# Altium project linkit-v4-hw.PrjPcb (part 1 of 2)
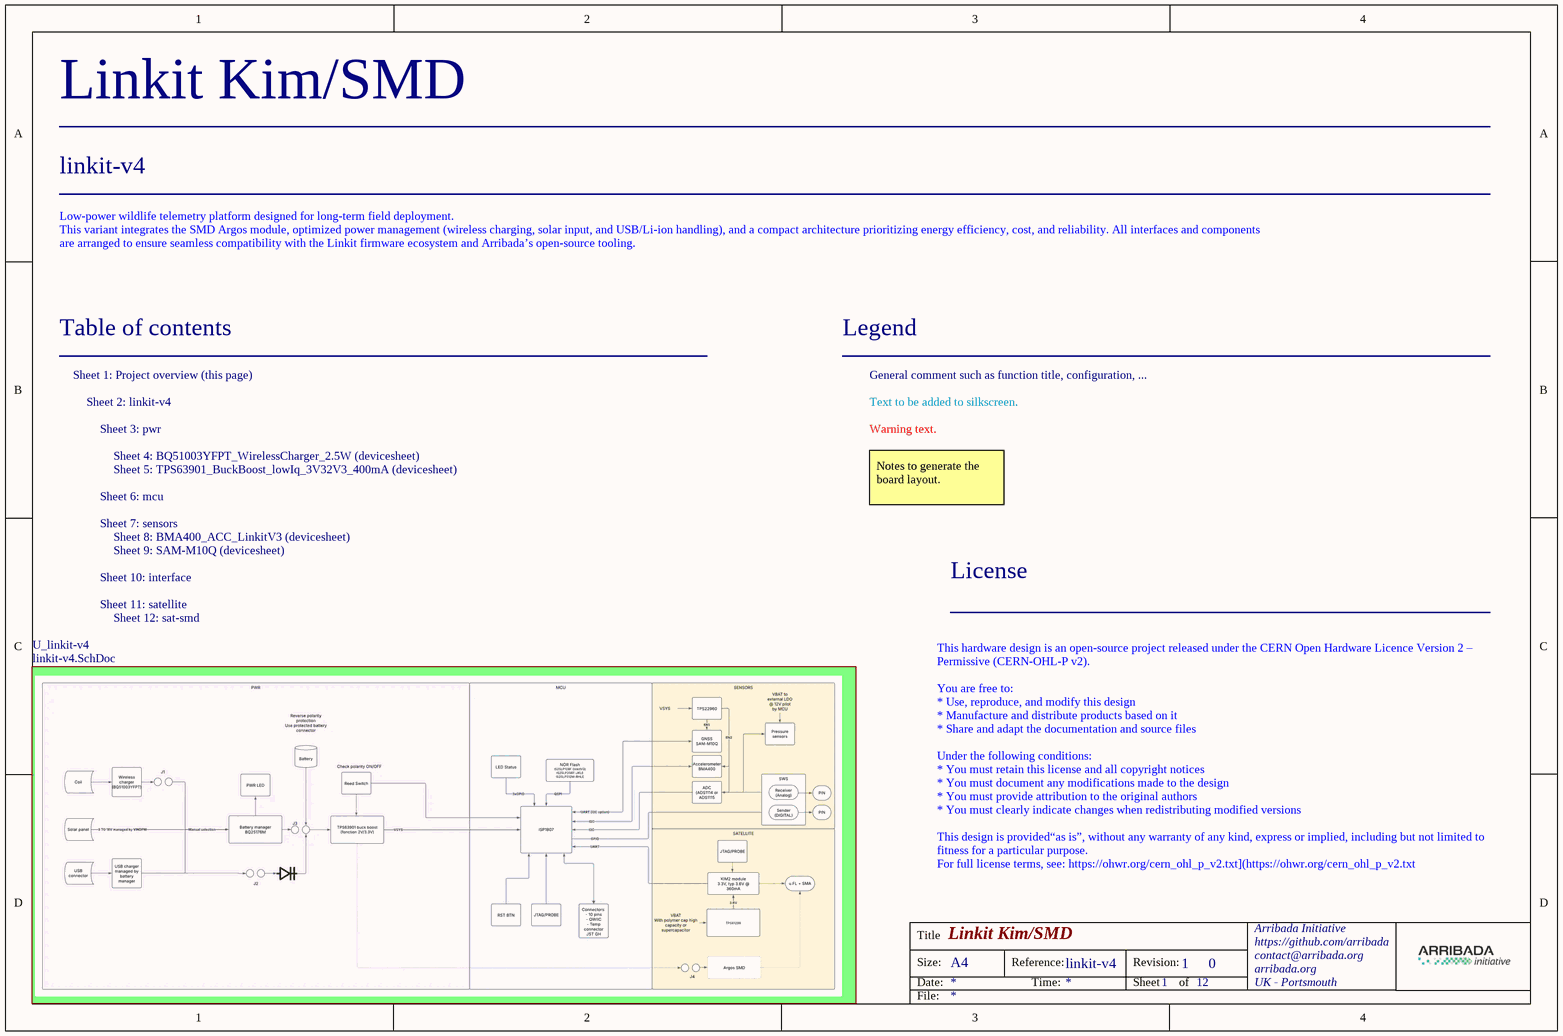
[diagram p0: Project_Overview.SchDoc]
Board_Assembly_Revision: 0; Board_Name: Linkit Kim/SMD; Board_PCB_Revision: 1; Board_Reference: linkit-v4
8 sheets, 140 parts. Net scope: flat (ports and power ports of the same name join across sheets).
Board file: linkit-v4-0.3_6layers_kimonly.PcbDoc
Sheets:
  Project_Overview.SchDoc
    U_linkit-v4 = linkit-v4.SchDoc
      ISP1807 = mcu.SchDoc
      Sensors = sensors.SchDoc
      Interface = interface.SchDoc
      Power = pwr.SchDoc
      Satellite = satellite.SchDoc
        KIM2 = sat-kim2.SchDoc

## Sheet Project_Overview.SchDoc
size A4; Organization: Arribada Initiative; Address1: https://github.com/arribada; Address2: contact@arribada.org; Address3: arribada.org; Address4: UK - Portsmouth; DocumentNumber: 1; SheetNumber: 1; SheetTotal: 12

### Sub-sheets
U_linkit-v4 = linkit-v4.SchDoc: no entries

### Notes on the sheet
- Low-power wildlife telemetry platform designed for long-term field deployment.
  This variant integrates the SMD Argos module, optimized power management (wireless charging, solar input, and USB/Li-ion handling), and a compact architecture prioritizing energy efficiency, cost, and reliability. All interfaces and components are arranged to ensure seamless compatibility with the Linkit firmware ecosystem and Arribada’s open-source tooling.
- Table of contents
- Sheet 1: Project overview (this page)
- Legend
- General comment such as function title, configuration, ...
- Sheet 2: linkit-v4
- Sheet 3: pwr
- Text to be added to silkscreen.
- Warning text.
- Sheet 6: mcu
- Sheet 4: BQ51003YFPT_WirelessCharger_2.5W (devicesheet)
- Sheet 5: TPS63901_BuckBoost_lowIq_3V32V3_400mA (devicesheet)
- Notes to generate the board layout.
- Sheet 7: sensors
- Sheet 10: interface
- Sheet 8: BMA400_ACC_LinkitV3 (devicesheet)
- Sheet 9: SAM-M10Q (devicesheet)
- License
- Sheet 11: satellite
- Sheet 12: sat-smd
- This hardware design is an open-source project released under the CERN Open Hardware Licence Version 2 – Permissive (CERN-OHL-P v2).
  You are free to:
  * Use, reproduce, and modify this design
  * Manufacture and distribute products based on it
  * Share and adapt the documentation and source files
  Under the following conditions:
  * You must retain this license and all copyright notices
  * You must document any modifications made to the design
  * You must provide attribution to the original authors
  * You must clearly indicate changes when redistributing modified versions
  This design is provided“as is”, without any warranty of any kind, express or implied, including but not limited to fitness for a particular purpose.
  For full license terms, see: https://ohwr.org/cern_ohl_p_v2.txt](https://ohwr.org/cern_ohl_p_v2.txt
  Attribution
  Designed and developed by **Arribada Initiative**
  https://arribada.org
- Title
- Size:
- Date:
- A4
- Reference:
- Time:
- Revision:
- Sheet
- of
- File:

## Sheet linkit-v4.SchDoc
size A4; Organization: Arribada Initiative; Address1: https://github.com/arribada; Address2: contact@arribada.org; Address3: arribada.org; Address4: UK - Portsmouth; DocumentNumber: 2; SheetNumber: 2; SheetTotal: 13
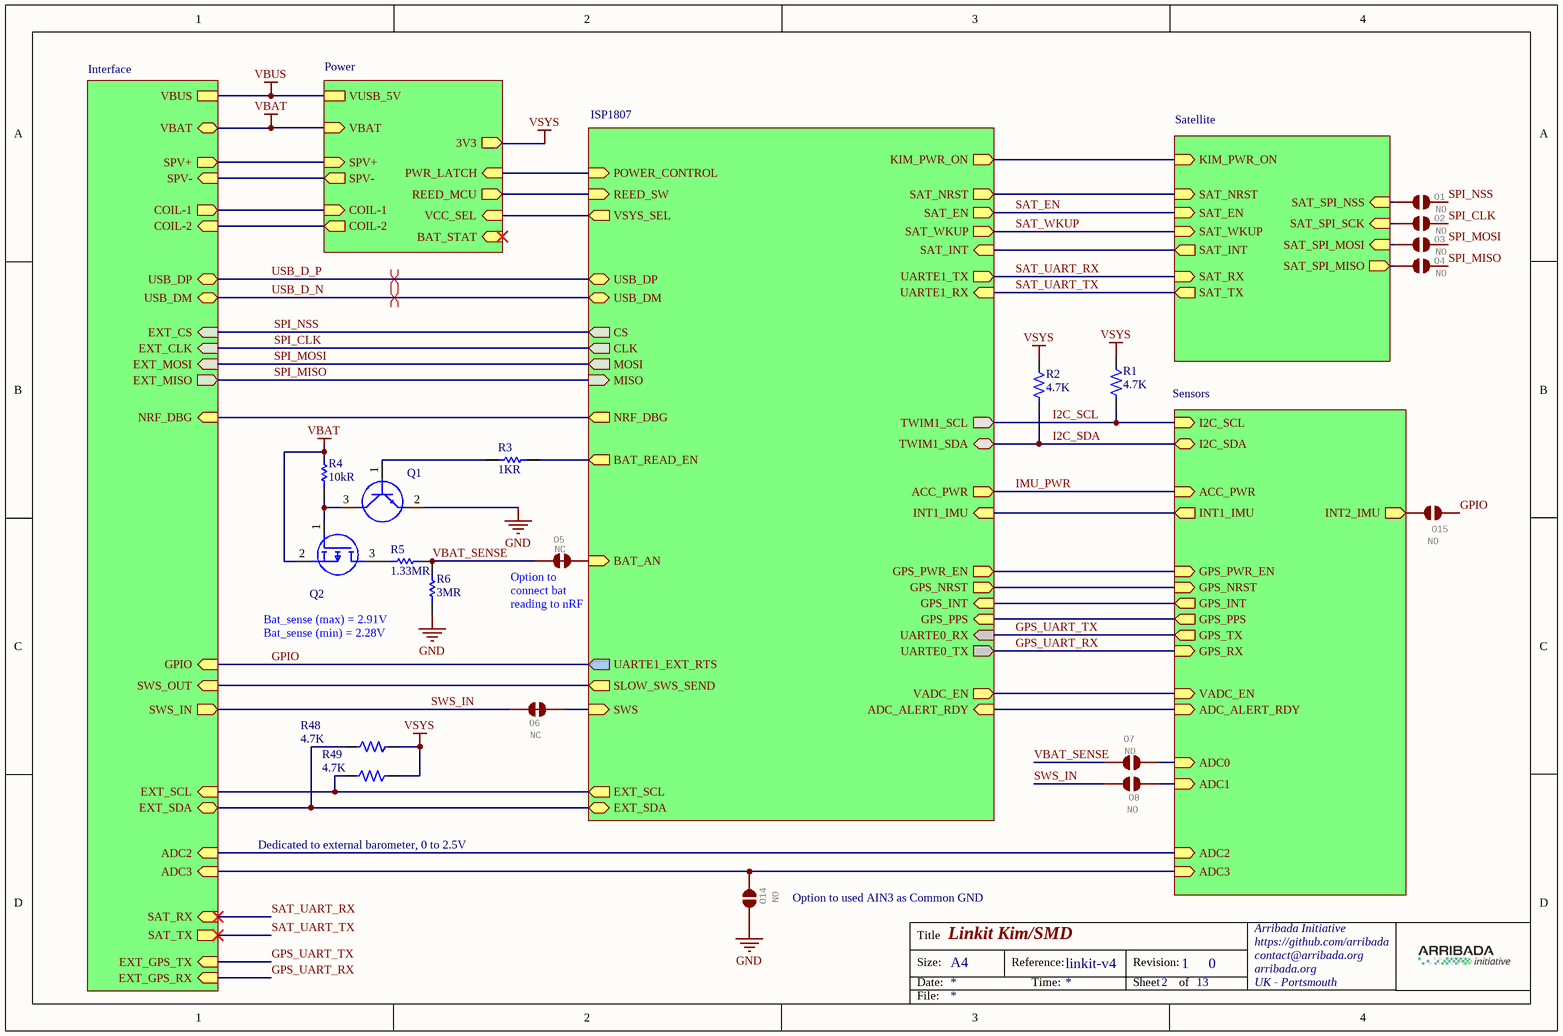
[diagram p1: linkit-v4.SchDoc]

### Parts
O1  NO  [SMT-JUMPER_2_NO_TRACE_SILK]  (net tie, no BOM)
O2  NO  [SMT-JUMPER_2_NO_TRACE_SILK]  (net tie, no BOM)
O3  NO  [SMT-JUMPER_2_NO_TRACE_SILK]  (net tie, no BOM)
O4  NO  [SMT-JUMPER_2_NO_TRACE_SILK]  (net tie, no BOM)
O5  NC  [SMT-JUMPER_2_NC_TRACE_SILK]  (net tie, no BOM)
O6  NC  [SMT-JUMPER_2_NC_TRACE_SILK]  (net tie, no BOM)
O7  NO  [SMT-JUMPER_2_NO_TRACE_SILK]  (net tie, no BOM)
O8  NO  [SMT-JUMPER_2_NO_TRACE_SILK]  (net tie, no BOM)
O14  NO  [SMT-JUMPER_2_NO_TRACE_SILK]  (net tie, no BOM)
O15  NO  [SMT-JUMPER_2_NO_TRACE_SILK]  (net tie, no BOM)
Q1  MMBT3904LT1G  [SOT96P237X111-3N]  (value not drawn)
Q2  DMP2305U-7  [SOT96P240X115-3N]  (value not drawn)
R1  value 4.7K  [RES0201L]  (hidden comment: 4.7K 0201 1% 100PPM)
R2  value 4.7K  [RES0201L]  (hidden comment: 4.7K 0201 1% 100PPM)
R3  1kR  [RESC0603X28N]
R4  value 10kR  [RESC1005X40N]  (hidden comment: CRCW040210K0JNEDC)
R5  value 1.33MR  [RESC2012X60N]  (hidden comment: RT0805BRD071M33L)
R6  value 3MR  [RESC3216X55N]  (hidden comment: RGV3216P-3004-B-T1)
R48  value 4.7K  [RES0201L]  (hidden comment: 4.7K 0201 1% 100PPM)
R49  value 4.7K  [RES0201L]  (hidden comment: 4.7K 0201 1% 100PPM)

### Sub-sheets
Interface = interface.SchDoc: USB_DP (bidir), USB_DM (bidir), VBUS, COIL-1 (out), COIL-2 (in), SWS_OUT (in), SWS_IN (out), EXT_CS (in), EXT_CLK (in), EXT_MISO (out), EXT_MOSI (in), NRF_DBG (in), ADC2 (in), EXT_SCL (in), EXT_SDA (bidir), VBAT (bidir), SAT_RX (in), SAT_TX (out), EXT_GPS_TX (in), EXT_GPS_RX (in), ADC3 (in), GPIO (in), SPV+ (out), SPV- (in)
ISP1807 = mcu.SchDoc: REED_SW (in), USB_DM (bidir), USB_DP (bidir), UARTE0_TX (out), UARTE0_RX (in), TWIM1_SCL (out), TWIM1_SDA (bidir), SWS (in), GPS_INT (in), UARTE1_EXT_RTS (out), VSYS_SEL (out), GPS_NRST (out), ADC_ALERT_RDY (in), CS (out), CLK (out), MISO (in), MOSI (out), SAT_NRST (out), SAT_INT (in), SAT_WKUP (out), SAT_EN (out), GPS_PWR_EN (out), BAT_AN (in), POWER_CONTROL (in), KIM_PWR_ON (out), SLOW_SWS_SEND (out), GPS_PPS (in), NRF_DBG (out), INT1_IMU (in), ACC_PWR (out), VADC_EN (out), BAT_READ_EN (out), UARTE1_TX (out), UARTE1_RX (in), EXT_SCL (out), EXT_SDA (bidir)
Power = pwr.SchDoc: VBAT (in), VCC_SEL (in), COIL-1 (in), COIL-2 (out), VUSB_5V, 3V3 (out), REED_MCU (out), PWR_LATCH (in), BAT_STAT (in), SPV+ (in), SPV- (out)
Satellite = satellite.SchDoc: SAT_RX (in), SAT_TX (out), SAT_WKUP (in), SAT_INT (out), SAT_EN (in), SAT_NRST (in), SAT_SPI_MISO (out), SAT_SPI_MOSI (in), SAT_SPI_NSS (in), SAT_SPI_SCK (in), KIM_PWR_ON (in)
Sensors = sensors.SchDoc: ADC0 (in), ADC1 (in), ADC2 (in), ADC_ALERT_RDY (in), VADC_EN (in), GPS_PWR_EN (in), GPS_RX (in), GPS_TX (out), GPS_NRST (in), GPS_INT (out), GPS_PPS (out), ACC_PWR (in), INT1_IMU (out), I2C_SCL (in), I2C_SDA (bidir), ADC3 (in), INT2_IMU (out)

### Nets
GND: O14.1 Q1.2(E) R6.2
VBAT: Q2.2(S) R4.1 ; sheet Interface/VBAT, sheet Power/VBAT
VBUS: sheet Interface/VBUS, sheet Power/VUSB_5V
VSYS: R1.2 R2.2 R48.2 R49.1 ; sheet Power/3V3
GPIO: O15.1 ; sheet ISP1807/UARTE1_EXT_RTS, sheet Interface/GPIO
GPS_UART_RX: sheet ISP1807/UARTE0_TX, sheet Sensors/GPS_RX, sheet Interface/EXT_GPS_RX
GPS_UART_TX: sheet ISP1807/UARTE0_RX, sheet Sensors/GPS_TX, sheet Interface/EXT_GPS_TX
I2C_SCL: R1.1 ; sheet ISP1807/TWIM1_SCL, sheet Sensors/I2C_SCL
I2C_SDA: R2.1 ; sheet ISP1807/TWIM1_SDA, sheet Sensors/I2C_SDA
IMU_PWR: sheet ISP1807/ACC_PWR, sheet Sensors/ACC_PWR
SAT_EN: sheet ISP1807/SAT_EN, sheet Satellite/SAT_EN
SAT_UART_RX: sheet ISP1807/UARTE1_TX, sheet Interface/SAT_RX, sheet Satellite/SAT_RX
SAT_UART_TX: sheet ISP1807/UARTE1_RX, sheet Interface/SAT_TX, sheet Satellite/SAT_TX
SAT_WKUP: sheet ISP1807/SAT_WKUP, sheet Satellite/SAT_WKUP
SPI_CLK: O2.2 ; sheet ISP1807/CLK, sheet Interface/EXT_CLK
SPI_MISO: O4.2 ; sheet ISP1807/MISO, sheet Interface/EXT_MISO
SPI_MOSI: O3.2 ; sheet ISP1807/MOSI, sheet Interface/EXT_MOSI
SPI_NSS: O1.2 ; sheet ISP1807/CS, sheet Interface/EXT_CS
SWS_IN: O6.1 O8.1 ; sheet Interface/SWS_IN
USB_D_N: sheet ISP1807/USB_DM, sheet Interface/USB_DM
USB_D_P: sheet ISP1807/USB_DP, sheet Interface/USB_DP
VBAT_SENSE: O5.1 O7.1 R5.2 R6.1
NetO1_1: O1.1 ; sheet Satellite/SAT_SPI_NSS
NetO2_1: O2.1 ; sheet Satellite/SAT_SPI_SCK
NetO3_1: O3.1 ; sheet Satellite/SAT_SPI_MOSI
NetO4_1: O4.1 ; sheet Satellite/SAT_SPI_MISO
NetO5_2: O5.2 ; sheet ISP1807/BAT_AN
NetO6_2: O6.2 ; sheet ISP1807/SWS
NetO7_2: O7.2 ; sheet Sensors/ADC0
NetO8_2: O8.2 ; sheet Sensors/ADC1
NetO14_2: O14.2 ; sheet Sensors/ADC3, sheet Interface/ADC3
NetO15_2: O15.2 ; sheet Sensors/INT2_IMU
NetQ1_1: Q1.1(B) R3.1
NetQ1_3: Q1.3(C) Q2.1(G) R4.2
NetQ2_3: Q2.3(D) R5.1
NetR3_2: R3.2 ; sheet ISP1807/BAT_READ_EN
NetR48_1: R48.1 ; sheet ISP1807/EXT_SDA, sheet Interface/EXT_SDA
NetR49_2: R49.2 ; sheet ISP1807/EXT_SCL, sheet Interface/EXT_SCL
(unnamed): sheet ISP1807/REED_SW, sheet Power/REED_MCU
(unnamed): sheet ISP1807/GPS_INT, sheet Sensors/GPS_INT
(unnamed): sheet ISP1807/VSYS_SEL, sheet Power/VCC_SEL
(unnamed): sheet ISP1807/GPS_NRST, sheet Sensors/GPS_NRST
(unnamed): sheet ISP1807/ADC_ALERT_RDY, sheet Sensors/ADC_ALERT_RDY
(unnamed): sheet ISP1807/SAT_NRST, sheet Satellite/SAT_NRST
(unnamed): sheet ISP1807/SAT_INT, sheet Satellite/SAT_INT
(unnamed): sheet ISP1807/GPS_PWR_EN, sheet Sensors/GPS_PWR_EN
(unnamed): sheet ISP1807/POWER_CONTROL, sheet Power/PWR_LATCH
(unnamed): sheet ISP1807/KIM_PWR_ON, sheet Satellite/KIM_PWR_ON
(unnamed): sheet ISP1807/SLOW_SWS_SEND, sheet Interface/SWS_OUT
(unnamed): sheet ISP1807/GPS_PPS, sheet Sensors/GPS_PPS
(unnamed): sheet ISP1807/NRF_DBG, sheet Interface/NRF_DBG
(unnamed): sheet ISP1807/INT1_IMU, sheet Sensors/INT1_IMU
(unnamed): sheet ISP1807/VADC_EN, sheet Sensors/VADC_EN
(unnamed): sheet Sensors/ADC2, sheet Interface/ADC2
(unnamed): sheet Interface/COIL-1, sheet Power/COIL-1
(unnamed): sheet Interface/COIL-2, sheet Power/COIL-2
(unnamed): sheet Interface/SPV+, sheet Power/SPV+
(unnamed): sheet Interface/SPV-, sheet Power/SPV-

### Layout directives
differential pair; rule Impedance Constraint [Min = 80.00    Max = 100.0    ]; differential pair class USB: USB_D_N, USB_D_P

### Notes on the sheet
- Bat_sense (max) = 2.91V
  Bat_sense (min) = 2.28V
- Type @ to refer to a designator
- (near O5) Option to connect bat reading to nRF
- Dedicated to external barometer, 0 to 2.5V
- (near O14) Option to used AIN3 as Common GND
- Title
- Size:
- Date:
- A4
- Reference:
- Time:
- Revision:
- Sheet
- of
- File:

### Library data of the parts
O1-O4 O7 O8 O14 O15 = JUMPER-SMT_2_NO_TRACE_SILK_1: Normally opened trace jumper / This jumper has no trace between two pads so it's normally closed (NO).; GateName_1: G$1; SymbolName_1: SMT-JUMPER_2_NC_TRACE; DeviceName: _SILK; DeviceSetName: JUMPER-SMT_2_NC_TRACE; LibraryName: SparkFun-Jumpers
O5 O6 = JUMPER-SMT_2_NC_TRACE_SILK: Normally closed trace jumper    This jumper has a trace between two pads so it's normally closed (NC). Use a razor knife to open the connection. For best results follow the IPC guidelines for cutting traces: Cutout at least 0.063 mm (0.005 in).  Remove all loose material to clean up the cut area.  Seal the cut with an approved epoxy.       Reapply solder to reclose the connection.; GateName_1: G$1; SymbolName_1: SMT-JUMPER_2_NC_TRACE; DeviceName: _SILK; LibraryName: SparkFun-Jumpers; DeviceSetName: JUMPER-SMT_2_NC_TRACE
Q1 = MMBT3904LT1G: Bipolar Transistors - BJT NPN GENERAL PURPOSE; Manufacturer_Name: onsemi; Datasheet Link: https://www.onsemi.com/pub/Collateral/MMBT3904LT1-D.PDF; Height: 1.11mm; Manufacturer_Part_Number: MMBT3904LT1G; Mouser Part Number: 863-MMBT3904LT1G; Mouser Price/Stock: https://www.mouser.co.uk/ProductDetail/onsemi/MMBT3904LT1G?qs=HVbQlW5zcXUYZ2Fy0YF3FQ%3D%3D; Arrow Part Number: MMBT3904LT1G; Arrow Price/Stock: https://www.arrow.com/en/products/mmbt3904lt1g/on-semiconductor?utm_currency=USD&region=europe
Q2 = DMP2305U-7: MOSFET P-CHANNEL ENHANCEMENT MODE; Manufacturer_Name: Diodes Incorporated; Datasheet Link: https://www.diodes.com//assets/Datasheets/DMP2305U.pdf; Height: 1.15mm; Manufacturer_Part_Number: DMP2305U-7; Mouser Part Number: 621-DMP2305U-7; Mouser Price/Stock: https://www.mouser.co.uk/ProductDetail/Diodes-Incorporated/DMP2305U-7?qs=oUsD4qhOtFyFQmlG8wLVjw%3D%3D; Arrow Part Number: DMP2305U-7; Arrow Price/Stock: https://www.arrow.com/en/products/dmp2305u-7/diodes-incorporated?utm_currency=USD&region=nac
R1 R2 R48 R49 = RES 4.7K 0201 1% 100PPM: PPM: 100; Manufacturer: *; Manufacturers Part Number: *; Tolerance: 1%; Size: 0201; Supplier 1: Mouser; Supplier 2: Digi-Key; Supplier Part Number 1: 71-CRCW02014K70FKED; Supplier Part Number 2: 541-4.70KAABCT-ND
R3 = CRCW02011K00FNED: Thick Film Resistors - SMD 1/20watt 1Kohms 1% 200ppm; Manufacturer_Name: Vishay; Datasheet Link: http://www.vishay.com/docs/20035/dcrcwe3.pdf; Height: 0.28mm; Manufacturer_Part_Number: CRCW02011K00FNED; Mouser Part Number: 71-CRCW02011K00FNED; Mouser Price/Stock: https://www.mouser.co.uk/ProductDetail/Vishay-Dale/CRCW02011K00FNED?qs=IQLUlsvFoXtTp7ngtIXo7A%3D%3D; Arrow Part Number: CRCW02011K00FNED; Arrow Price/Stock: https://www.arrow.com/en/products/crcw02011k00fned/vishay?region=nac; Value: 1KR
R4 = CRCW040210K0JNEDC: Thick Film Resistors - SMD 1/16watt 10Kohms 5% Commercial Use; Manufacturer: Vishay Semiconductors; Power Rating: 63mW; Voltage Rating: 50V; Supplier 1: Mouser; Manufacturer Part Number: CRCW040210K0JNEDC; RoHS: Yes; Category: Chip SMD Resistors; Stock 1: 229087; Pricing 1: 1=0,1, 10=0,013, 50=0,013, 100=0,007, 1000=0,005, 10000=0,004 (USD); Case/Package: 343Case; Resistance: 10kR; Tolerance: 5%; Height: 350um; Lead Free: 5697LeadFree; ComponentLink1URL: http://www.vishay.com/docs/28773/crcwce3.pdf?src-supplier=Digikey; ComponentLink1Description: http://www.vishay.com/docs/28773/crcwce3.pdf?src-supplier=Digikey; ComponentLink2URL: https://datasheet.octopart.com/CRCW040210K0JNEDC-Vishay-datasheet-100063072.pdf?src-supplier=Future+Electronics; ComponentLink2Description: https://datasheet.octopart.com/CRCW040210K0JNEDC-Vishay-datasheet-100063072.pdf?src-supplier=Future+Electronics; Supplier Part Number 1: 71-CRCW040210K0JNEDC
R5 = RT0805BRD071M33L: Thin Film Resistors - SMD 1/8W 1.33M Ohms 0.1%; Manufacturer: Yageo; Power Rating: 125mW; Temperature Coefficient: 25ppm/°C; Voltage Rating: 150V; Supplier: Mouser; Supplier Part Number: 603-RT0805BRD071M33L; Manufacturer Part Number: RT0805BRD071M33L; RoHS: Yes; Category: Chip SMD Resistors; Stock: 4964; Pricing: 1=0,19, 10=0,135, 50=0,108, 100=0,097, 1000=0,065, 10000=0,043 (USD); Case/Package: 339Case; Min Operating Temperature: -55°C; Max Operating Temperature: 155°C; Packaging: 10Packaging; Height: 600um; RoHS Compliant: Yes
R6 = RGV3216P-3004-B-T1: Thin Film Resistors - SMD Thin Film Chip Resistors 1206 size, 700V, 0.25W, 3.0M ohm, 0.1%, 25ppm AEC Q200; Manufacturer_Name: Susumu; Datasheet Link: https://www.mouser.in/datasheet/2/392/n_catalog_partition39_en-1919331.pdf; Height: 0.55mm; Manufacturer_Part_Number: RGV3216P-3004-B-T1

## Sheet mcu.SchDoc
size A3; DocumentNumber: 6; SheetNumber: 6; SheetTotal: 13; Organization: Arribada Initiative; Address1: https://github.com/arribada; Address2: contact@arribada.org; Address3: arribada.org; Address4: UK - Porthmouth
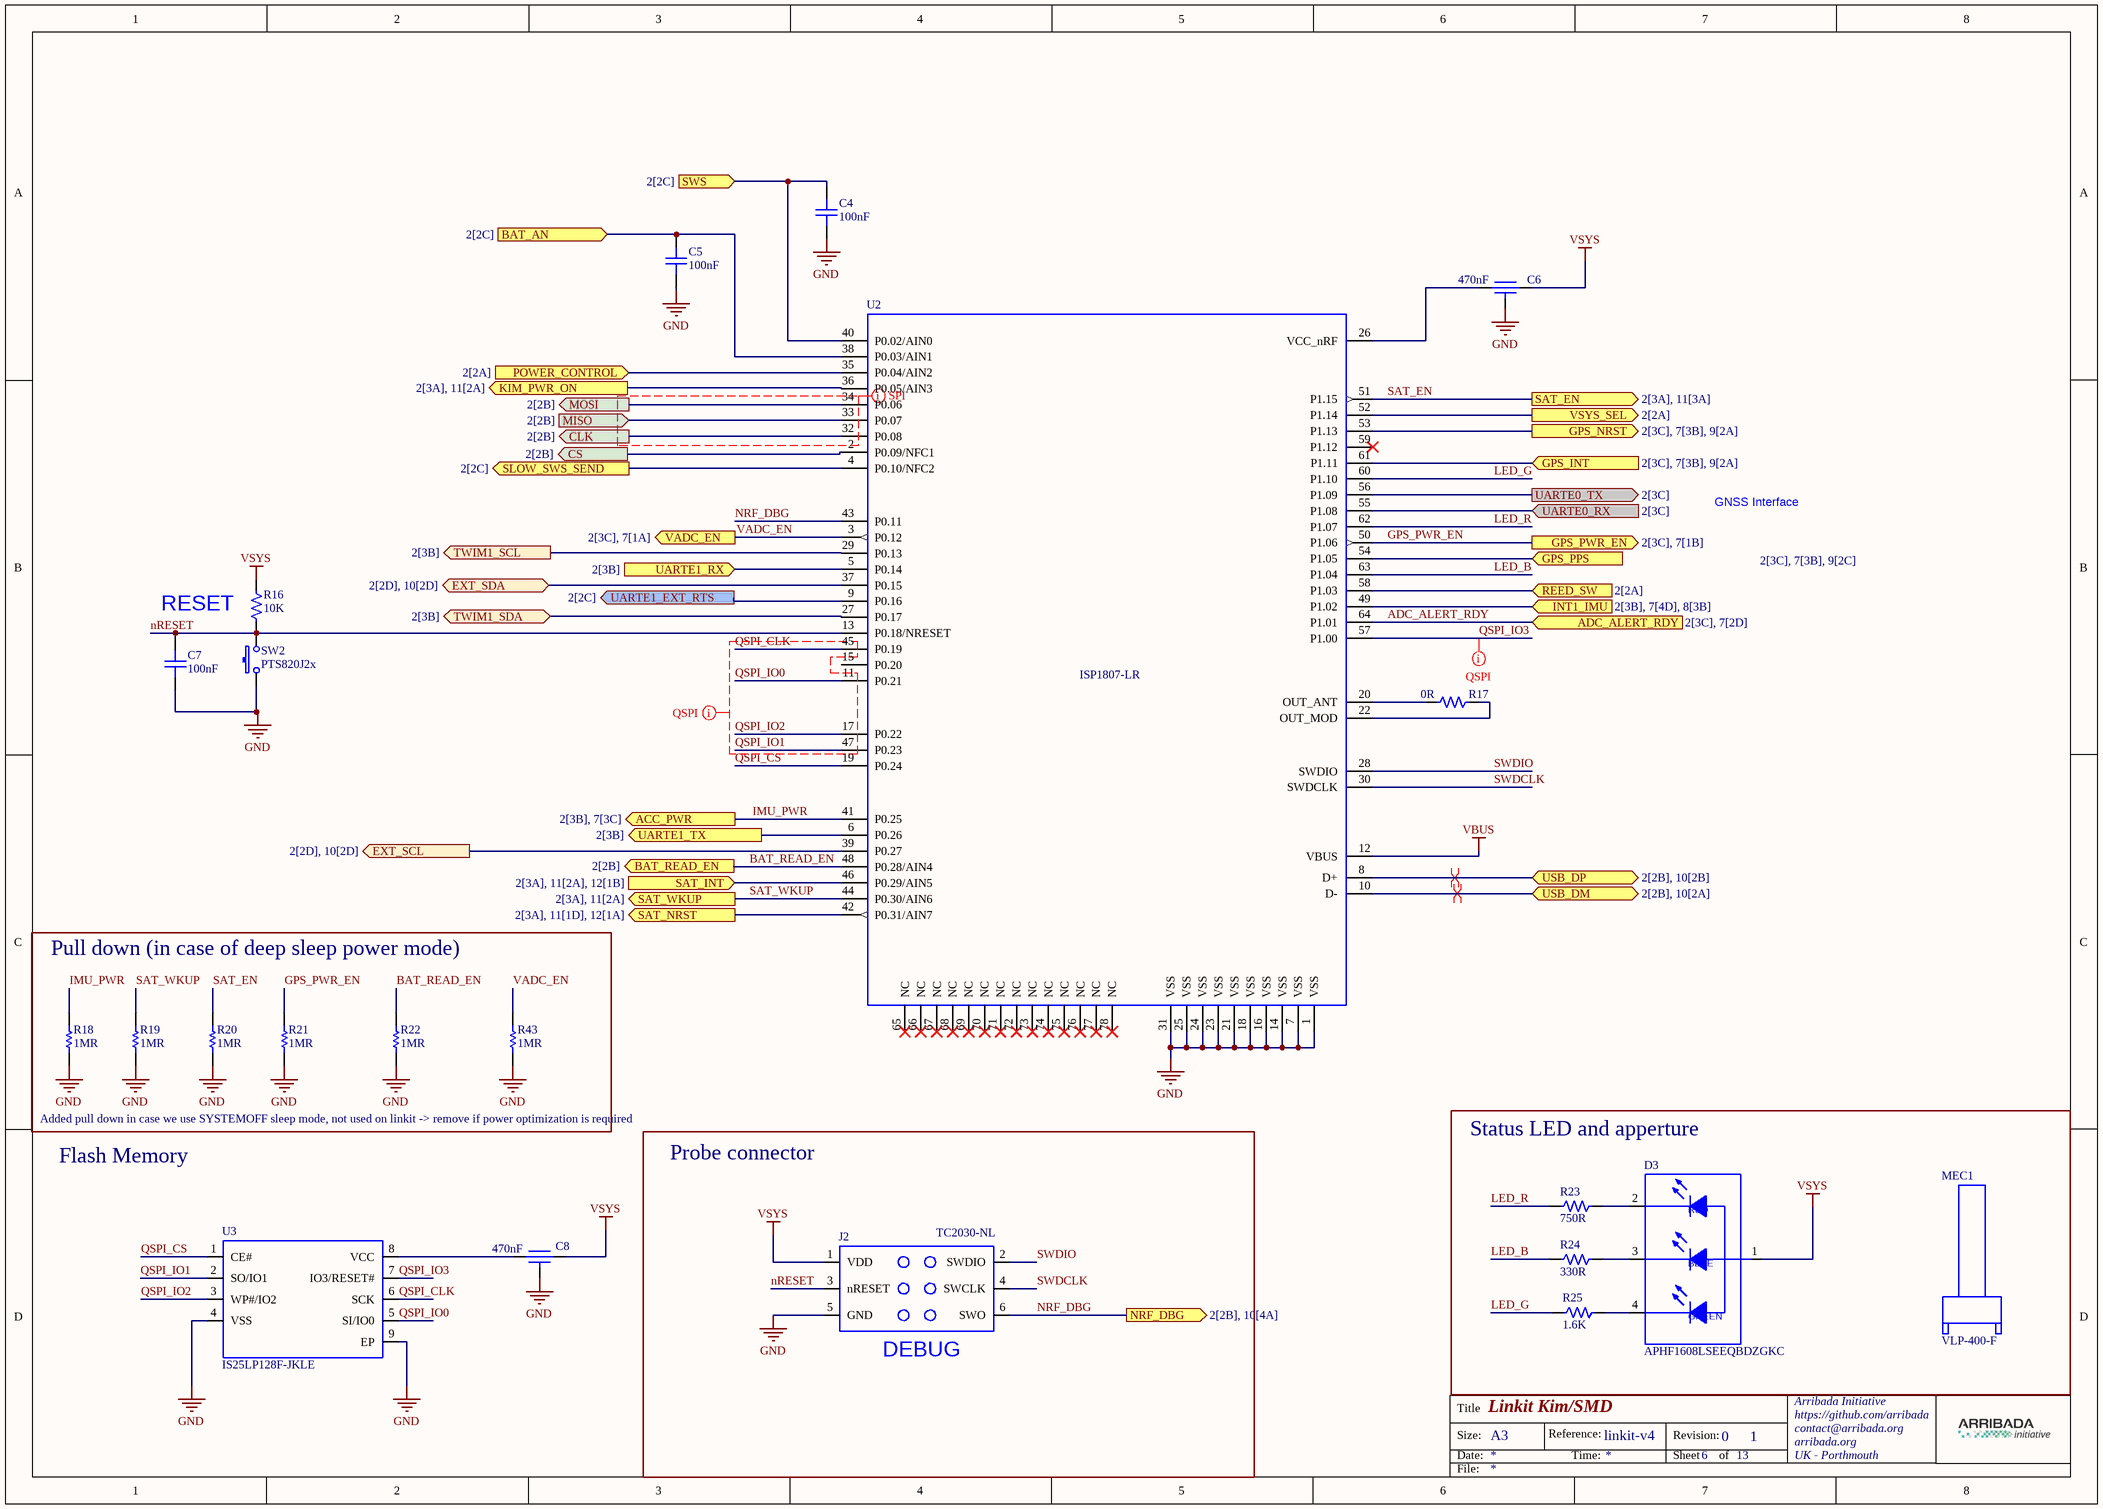
[diagram p2: mcu.SchDoc]

### Parts
C4  value 100nF  [CAP0201L]  (hidden comment: 100NF 0201 35V 10% X5R)
C5  value 100nF  [CAP0201L]  (hidden comment: 100NF 0201 35V 10% X5R)
C6  value 470nF  [YFF15PC]  (hidden comment: 470NF 0402 6.3V +50%/-20%)
C7  value 100nF  [CAP0201L]  (hidden comment: 100NF 0201 35V 10% X5R)
C8  value 470nF  [YFF15PC]  (hidden comment: 470NF 0402 6.3V +50%/-20%)
D3  APHF1608LSEEQBDZGKC  [LED RGB 0603]
J2  TC2030-NL  [TC2030NL]
MEC1  VLP-400-F  [VLP-400-F]
R16  value 10K  [RES0201L]  (hidden comment: 10K 0201 1% 100PPM)
R17  value 0R  [RES0201N]  (hidden comment: 0R 0201)
R18  value 1MR  [RESC0603X26N]  (hidden comment: RC0201FR-7D1ML)
R19  value 1MR  [RESC0603X26N]  (hidden comment: RC0201FR-7D1ML)
R20  value 1MR  [RESC0603X26N]  (hidden comment: RC0201FR-7D1ML)
R21  value 1MR  [RESC0603X26N]  (hidden comment: RC0201FR-7D1ML)
R22  value 1MR  [RESC0603X26N]  (hidden comment: RC0201FR-7D1ML)
R23  value 750R  [RES0201L]  (hidden comment: 750R 0201 1% 100PPM)
R24  value 330R  [RES0201L]  (hidden comment: 330R 0201 1% 100PPM)
R25  value 1.6K  [RES0201L]  (hidden comment: 1.6K 0201 1% 100PPM)
R43  value 1MR  [RESC0603X26N]  (hidden comment: RC0201FR-7D1ML)
SW2  PTS820J2x  [TL1015]
U2  ISP1807-LR  [ISP1807-LR]
U3  IS25LP128F-JKLE  [SON127P600X80_HS-9N]

### Blocks framed on the sheet
Pull down (in case of deep sleep power mode): R18-R22 R43
Probe connector: J2
Status LED and apperture: D3 MEC1 R23-R25

### Ports
ACC_PWR (out, see 2[3B], 7[3C]), ADC_ALERT_RDY (in, see 2[3C], 7[2D]), BAT_AN (in, see 2[2C]), BAT_READ_EN (out, see 2[2B]), CLK (out, see 2[2B]), CS (out, see 2[2B]), EXT_SCL (out, see 2[2D], 10[2D]), EXT_SDA (bidir, see 2[2D], 10[2D]), GPS_INT (in, see 2[3C], 7[3B], 9[2A]), GPS_NRST (out, see 2[3C], 7[3B], 9[2A]), GPS_PPS (in, see 2[3C], 7[3B], 9[2C]), GPS_PWR_EN (out, see 2[3C], 7[1B]), INT1_IMU (in, see 2[3B], 7[4D], 8[3B]), KIM_PWR_ON (out, see 2[3A], 11[2A]), MISO (in, see 2[2B]), MOSI (out, see 2[2B]), NRF_DBG (out, see 2[2B], 10[4A]), POWER_CONTROL (in, see 2[2A]), REED_SW (in, see 2[2A]), SAT_EN (out, see 2[3A], 11[3A]), SAT_INT (in, see 2[3A], 11[2A], 12[1B]), SAT_NRST (out, see 2[3A], 11[1D], 12[1A]), SAT_WKUP (out, see 2[3A], 11[2A]), SLOW_SWS_SEND (out, see 2[2C]), SWS (in, see 2[2C]), TWIM1_SCL (out, see 2[3B]), TWIM1_SDA (bidir, see 2[3B]), UARTE0_RX (in, see 2[3C]), UARTE0_TX (out, see 2[3C]), UARTE1_EXT_RTS (out, see 2[2C]), UARTE1_RX (in, see 2[3B]), UARTE1_TX (out, see 2[3B]), USB_DM (bidir, see 2[2B], 10[2A]), USB_DP (bidir, see 2[2B], 10[2B]), VADC_EN (out, see 2[3C], 7[1A]), VSYS_SEL (out, see 2[2A])

### Nets
GND: C4.1 C5.1 C6.3 C7.1 C8.3 J2.5(GND) R18.1 R19.1 R20.1 R21.1 R22.1 R43.1 SW2.1 SW2.G1 SW2.G2 SW2.G3 SW2.G4 U2.1(VSS) U2.7(VSS) U2.14(VSS) U2.16(VSS) U2.18(VSS) U2.21(VSS) U2.23(VSS) U2.24(VSS) U2.25(VSS) U2.31(VSS) U3.4(VSS) U3.9(EP)
VBUS: U2.12(VBUS)
VSYS: C6.1 C8.1 D3.1 J2.1(VDD) R16.2
ADC_ALERT_RDY: U2.64(P1.01) ; port ADC_ALERT_RDY
BAT_AN: C5.2 U2.38(P0.03/AIN1) ; port BAT_AN
BAT_READ_EN: R22.2 U2.48(P0.28/AIN4) ; port BAT_READ_EN
CLK: U2.32(P0.08) ; port CLK
CS: U2.2(P0.09/NFC1) ; port CS
EXT_SCL: U2.39(P0.27) ; port EXT_SCL
EXT_SDA: U2.37(P0.15) ; port EXT_SDA
GPS_INT: U2.61(P1.11) ; port GPS_INT
GPS_NRST: U2.53(P1.13) ; port GPS_NRST
GPS_PPS: U2.54(P1.05) ; port GPS_PPS
GPS_PWR_EN: R21.2 U2.50(P1.06) ; port GPS_PWR_EN
IMU_PWR: R18.2 U2.41(P0.25) ; port ACC_PWR
INT1_IMU: U2.49(P1.02) ; port INT1_IMU
KIM_PWR_ON: U2.36(P0.05/AIN3) ; port KIM_PWR_ON
LED_B: R24.1 U2.63(P1.04)
LED_G: R25.1 U2.60(P1.10)
LED_R: R23.1 U2.62(P1.07)
MISO: U2.33(P0.07) ; port MISO
MOSI: U2.34(P0.06) ; port MOSI
nRESET: C7.2 J2.3(nRESET) R16.1 SW2.2 U2.13(P0.18/NRESET)
nRESET-SAT: U2.42(P0.31/AIN7) ; port SAT_NRST
NRF_DBG: J2.6(SWO) U2.43(P0.11) ; port NRF_DBG
POWER_CONTROL: U2.35(P0.04/AIN2) ; port POWER_CONTROL
QSPI_CLK: U2.45(P0.19) U3.6(SCK)
QSPI_CS: U2.19(P0.24) U3.1(CE#)
QSPI_IO0: U2.11(P0.21) U3.5(SI/IO0)
QSPI_IO1: U2.47(P0.23) U3.2(SO/IO1)
QSPI_IO2: U2.17(P0.22) U3.3(WP#/IO2)
QSPI_IO3: U2.57(P1.00) U3.7(IO3/RESET#)
REED_SW: U2.58(P1.03) ; port REED_SW
SAT_EN: R20.2 U2.51(P1.15) ; port SAT_EN
SAT_INT: U2.46(P0.29/AIN5) ; port SAT_INT
SAT_WKUP: R19.2 U2.44(P0.30/AIN6) ; port SAT_WKUP
SLOW_SWS_SEND: U2.4(P0.10/NFC2) ; port SLOW_SWS_SEND
SWDCLK: J2.4(SWCLK) U2.30(SWDCLK)
SWDIO: J2.2(SWDIO) U2.28(SWDIO)
SWS: C4.2 U2.40(P0.02/AIN0) ; port SWS
TWIM1_SCL: U2.29(P0.13) ; port TWIM1_SCL
TWIM1_SDA: U2.27(P0.17) ; port TWIM1_SDA
UARTE0_RX: U2.55(P1.08) ; port UARTE0_RX
UARTE0_TX: U2.56(P1.09) ; port UARTE0_TX
UARTE1_EXT_RTS: U2.9(P0.16) ; port UARTE1_EXT_RTS
UARTE1_RX: U2.5(P0.14) ; port UARTE1_RX
UARTE1_TX: U2.6(P0.26) ; port UARTE1_TX
USB_D_N: U2.10(D-) ; port USB_DM
USB_D_P: U2.8(D+) ; port USB_DP
VADC_EN: R43.2 U2.3(P0.12) ; port VADC_EN
VSYS_SEL: U2.52(P1.14) ; port VSYS_SEL
NetC6_2: C6.2 U2.26(VCC_nRF)
NetC8_2: C8.2 U3.8(VCC)
NetD3_2: D3.2 R23.2
NetD3_3: D3.3 R24.2
NetD3_4: D3.4 R25.2
NetR17_1: R17.1 U2.20(OUT_ANT)
NetR17_2: R17.2 U2.22(OUT_MOD)

Not connected (* = marked no-connect by the designer): U2 15(P0.20) 59(P1.12)* 65(NC)* 66(NC)* 67(NC)* 68(NC)* 69(NC)* 70(NC)* 71(NC)* 72(NC)* 73(NC)* 74(NC)* 75(NC)* 76(NC)* 77(NC)* 78(NC)*

### Layout directives
net class QSPI: QSPI_CLK, QSPI_IO0, QSPI_IO1, QSPI_IO2, QSPI_IO3
differential pair; rule Impedance Constraint [Min = 80.00    Max = 100.0    ]; differential pair class USB: USB_D_N, USB_D_P
net class SPI: (no net found under the mark)

### Notes on the sheet
- GNSS Interface
- RESET
- Added pull down in case we use SYSTEMOFF sleep mode, not used on linkit -> remove if power optimization is required
- Flash Memory
- Title
- Size:
- Date:
- A3
- Reference:
- Time:
- Revision:
- Sheet
- of
- File:
- (in symbol LED RGB 0603 2MA) RED; BLUE; GREEN
- (in symbol TC2030-NL) DEBUG

### Library data of the parts
C4 C5 C7 = CAP CER 100NF 0201 35V 10% X5R: Manufacturer: Murata; Manufacturers Part Number: GRM033R6YA104KE14D; Tolerance: 10%; Size: 0201; Dielectric: X5R; Supplier 1: Mouser; Supplier 2: Digi-Key; Supplier Part Number 1: 81-GRM33R6YA104KE14D; Supplier Part Number 2: 490-10430-1-ND
C6 C8 = CAP FEEDTHRU 470NF 0402 6.3V +50%/-20%: Manufacturer: TDK; Manufacturers Part Number: YFF15PC0J474M; Tolerance: +50%/-20%; Size: 0402; Voltage: 6.3V; Supplier 1: Mouser; Supplier 2: Digi-Key; Supplier Part Number 1: 810-CKD710JB0J474S; Supplier Part Number 2: 445-8050-1-ND
D3 = LED RGB 0603 2MA: Manufacturer: Kingbright; Manufacturers Part Number: APHF1608LSEEQBDZGKC; Supplier 1: Mouser; Supplier 2: Digi-Key; Supplier Part Number 1: 604-APHF1608LQBDZGKC; Supplier Part Number 2: 754-2143-1-ND; Distributor 1: EBV; Distributor 2: Future Electronics; Colour: RGB; Value: APHF1608LSEEQBDZGKC
J2 = TC2030-NL: CON PLUG OF NAILS 6 PIN FOOTPRINT NO LEGS; Manufacturer: Tag-Connect; Manufacturers Part Number: NOT FITTED PART; Supplier Part Number 1: NOT FITTED PART; Supplier Part Number 2: NOT FITTED PART; Distributor 1: EBV; Distributor 2: Future Electronics
MEC1 = VLP-400-F: LIGHT PIPE 10.2mm High Flat Face; Manufacturer: Bivar Inc; Manufacturers Part Number: VLP-400-F; Supplier 1: Digi-Key; Supplier 2: Mouser; Supplier Part Number 1: 492-1516-ND; Supplier Part Number 2: 749-VLP-400-F
R16 = RES 10K 0201 1% 100PPM: PPM: 100; Manufacturer: *; Manufacturers Part Number: *; Tolerance: 1%; Size: 0201; Supplier 1: Mouser; Supplier 2: Digi-Key; Supplier Part Number 1: 71-CRCW020110K0FKED; Supplier Part Number 2: 541-10.0KAABCT-ND
R17 = RES 0R 0201: Manufacturer: *; Manufacturers Part Number: *; Size: 0201; Supplier 1: Mouser; Supplier 2: Digi-Key; Supplier Part Number 1: 71-CRCW02010000Z0ED; Supplier Part Number 2: 541-0.0AGCT-ND
R18-R22 R43 = RC0201FR-7D1ML: Thick Film Resistors - SMD 1 MOhms 50 mW 0201 1%; Manufacturer_Name: KEMET; Datasheet Link: http://www.yageo.com/documents/recent/PYu-RC0201_51_RoHS_L_8.pdf; Height: 0.26mm; Manufacturer_Part_Number: RC0201FR-7D1ML; Mouser Part Number: 603-RC0201FR-7D1ML; Mouser Price/Stock: https://www.mouser.co.uk/ProductDetail/YAGEO/RC0201FR-7D1ML?qs=NgbZBzc1CyEo5FlGf5N0Ug%3D%3D; Arrow Part Number: RC0201FR-7D1ML; Arrow Price/Stock: https://www.arrow.com/en/products/rc0201fr-7d1ml/yageo
R23 = RES 750R 0201 1% 100PPM: PPM: 100; Manufacturer: *; Manufacturers Part Number: *; Tolerance: 1%; Size: 0201; Supplier 1: Mouser; Supplier 2: Digi-Key; Supplier Part Number 1: 71-CRCW0201750RFKED; Supplier Part Number 2: 541-750AABCT-ND
R24 = RES 330R 0201 1% 100PPM: PPM: 100; Manufacturer: *; Manufacturers Part Number: *; Tolerance: 1%; Size: 0201; Supplier 1: Mouser; Supplier 2: Digi-Key; Supplier Part Number 1: 71-CRCW0201330RFKED; Supplier Part Number 2: 541-330AABCT-ND
R25 = RES 1.6K 0201 1% 100PPM: PPM: 100; Manufacturer: *; Manufacturers Part Number: *; Tolerance: 1%; Size: 0201; Supplier 1: Mouser; Supplier 2: Digi-Key; Supplier Part Number 1: 71-CRCW02011K60FKED; Supplier Part Number 2: 541-1.60KAABCT-ND
SW2 = PTS820J2x: SW SPST PB 50MA 12V SMT CK variant; Manufacturer: C&K; Manufacturers Part Number: PTS820J2xM SMTR LFS; Supplier 1: Mouser; Supplier 2: Digi-Key; Supplier Part Number 1: 611-PTS820J25MSMTR; Supplier Part Number 2: CKN10505CT-ND; Distributor 1: EBV; Distributor 2: Future Electronics; Value: PTS820J2x
U2 = ISP1807-LR: IC ISP Smart Bluetooth Module; Manufacturer: InsightSIP; Manufacturers Part Number: ISP1807-LR-ST; Temp Min: -40; Temp Max: 85; Supplier 1: Rutronik; Supplier Part Number 1: ISP1807-LR-ST; Supplier 2: Mouser; Supplier Part Number 2: 359-ISP1807-LR-ST; Supplier Unit Price 1: 8.5
U3 = IS25LP128F-JKLE: IC MEM SERIAL NOR FLASH QSPI 128Mb/16MB 3.6V 166MHz WSON8 6X5; Manufacturer: ISSI; Manufacturers Part Number: IS25LP128F-JKLE; Temp Min: -40; Temp Max: 105; Supplier 1: Farnell; Supplier Part Number 1: 2901145; Supplier 2: Mouser; Supplier Part Number 2: 870-IS25LP128FJKLETR; Distributor 1: EBV; Distributor 2: Future Electronics

## Sheet sensors.SchDoc
size A4; Organization: Arribada Initiative; Address1: https://github.com/arribada; Address2: contact@arribada.org; Address3: arribada.org; Address4: UK - Portsmouth; DocumentNumber: 7; SheetNumber: 7; SheetTotal: 13
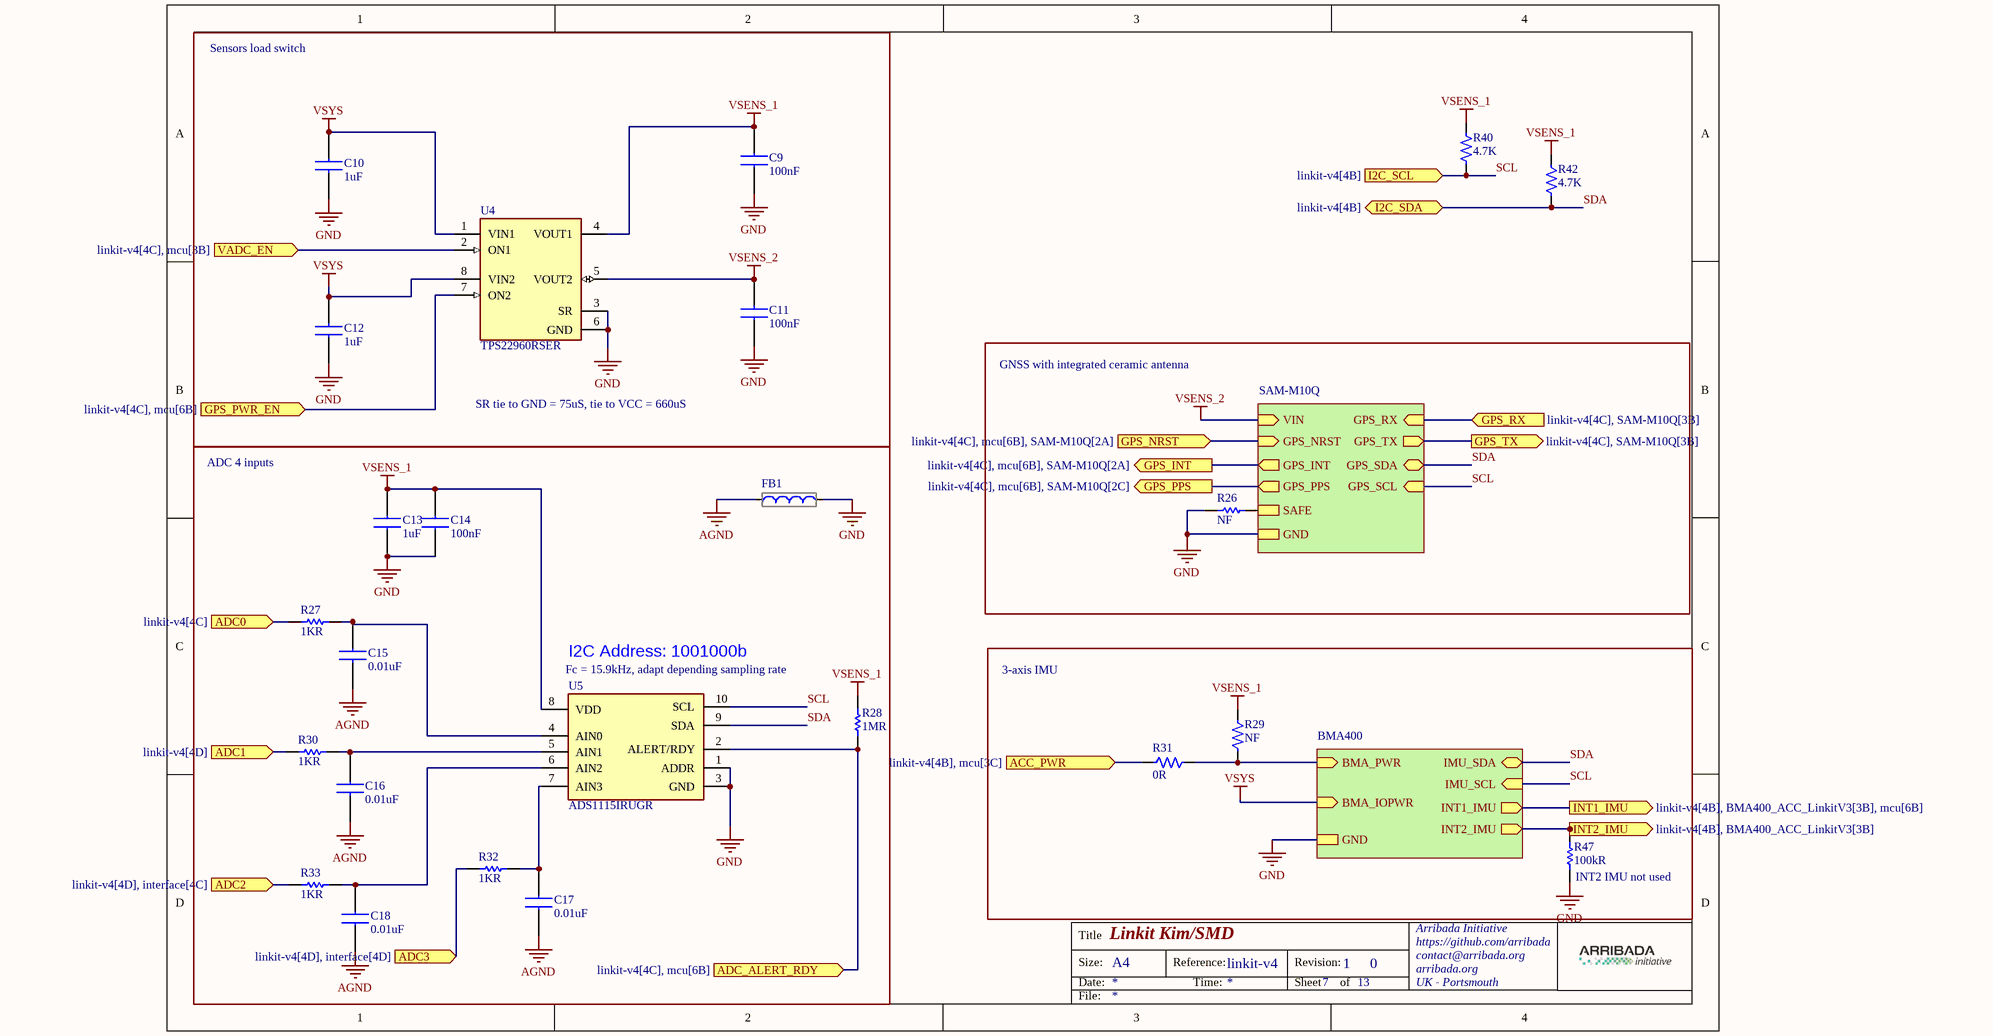
[diagram p3: sensors.SchDoc]

### Parts
C9  value 100nF  [0402]  (hidden comment: GRM155R71C104KA88D)
C10  1uF  [CAPC1005X55N]
C11  value 100nF  [0402]  (hidden comment: GRM155R71C104KA88D)
C12  1uF  [CAPC1005X55N]
C13  1uF  [CAPC1005X55N]
C14  value 100nF  [0402]  (hidden comment: GRM155R71C104KA88D)
C15  value 0.01uF  [GRM15x]  (hidden comment: GRM1555CYA103GE01D)
C16  value 0.01uF  [GRM15x]  (hidden comment: GRM1555CYA103GE01D)
C17  value 0.01uF  [GRM15x]  (hidden comment: GRM1555CYA103GE01D)
C18  value 0.01uF  [GRM15x]  (hidden comment: GRM1555CYA103GE01D)
FB1  BLM18HE601SN1D  [BLM18SP221SN1B]  (value not drawn)
R26  value NF  [R0402]  (hidden comment: Resistor)
R27  1kR  [RESC0603X28N]
R28  value 1MR  [RESC0603X26N]  (hidden comment: RC0201FR-7D1ML)
R29  value NF  [RES0402N_NF]  (hidden comment: RES NF 0402)
R30  1kR  [RESC0603X28N]
R31  value 0R  [RES0402N]  (hidden comment: 0R 0402)
R32  1kR  [RESC0603X28N]
R33  1kR  [RESC0603X28N]
R40  value 4.7K  [RES0201L]  (hidden comment: 4.7K 0201 1% 100PPM)
R42  value 4.7K  [RES0201L]  (hidden comment: 4.7K 0201 1% 100PPM)
R47  value 100kR  [RESC0603X28N]  (hidden comment: CRCW0201100KJNED)
U4  TPS22960RSER  [TPS22960RSER]
U5  ADS1115IRUGR  [ADS1115IRUGR]

### Blocks framed on the sheet
GNSS with integrated ceramic antenna: R26
I2C Address: 1001000b: C13-C18 FB1 R27 R28 R30 R32 R33 U5

### Sub-sheets
BMA400 = BMA400_ACC_LinkitV3 (file not in this document): INT1_IMU (out), INT2_IMU (out), BMA_PWR (in), IMU_SDA (bidir), IMU_SCL (in), GND, BMA_IOPWR (in)
SAM-M10Q = SAM-M10Q (file not in this document): GPS_NRST (in), GPS_INT (out), GPS_SDA (bidir), GPS_PPS (out), VIN (in), GPS_TX (out), GPS_SCL (in), GPS_RX (in), GND, SAFE

### Ports
ACC_PWR (in, see linkit-v4[4B], mcu[3C]), ADC0 (in, see linkit-v4[4C]), ADC1 (in, see linkit-v4[4D]), ADC2 (in, see linkit-v4[4D], interface[4C]), ADC3 (in, see linkit-v4[4D], interface[4D]), ADC_ALERT_RDY (in, see linkit-v4[4C], mcu[6B]), GPS_INT (out, see linkit-v4[4C], mcu[6B], SAM-M10Q[2A]), GPS_NRST (in, see linkit-v4[4C], mcu[6B], SAM-M10Q[2A]), GPS_PPS (out, see linkit-v4[4C], mcu[6B], SAM-M10Q[2C]), GPS_PWR_EN (in, see linkit-v4[4C], mcu[6B]), GPS_RX (in, see linkit-v4[4C], SAM-M10Q[3B]), GPS_TX (out, see linkit-v4[4C], SAM-M10Q[3B]), I2C_SCL (in, see linkit-v4[4B]), I2C_SDA (bidir, see linkit-v4[4B]), INT1_IMU (out, see linkit-v4[4B], BMA400_ACC_LinkitV3[3B], mcu[6B]), INT2_IMU (out, see linkit-v4[4B], BMA400_ACC_LinkitV3[3B]), VADC_EN (in, see linkit-v4[4C], mcu[3B])

### Nets
AGND: C15.2 C16.2 C17.2 C18.2 FB1.1
GND: C9.2 C10.1 C11.2 C12.1 C13.1 C14.2 FB1.2 R26.1 R47.2 U4.3(SR) U4.6(GND) U5.1(ADDR) U5.3(GND) ; sheet SAM-M10Q/GND, sheet BMA400/GND
VSENS_1: C9.1 C13.2 C14.1 R28.1 R29.2 R40.2 R42.2 U4.4(VOUT1) U5.8(VDD)
VSENS_2: C11.1 U4.5(VOUT2) ; sheet SAM-M10Q/VIN
VSYS: C10.2 C12.2 U4.1(VIN1) U4.8(VIN2) ; sheet BMA400/BMA_IOPWR
ADC0: R27.1 ; port ADC0
ADC1: R30.1 ; port ADC1
ADC2: R33.1 ; port ADC2
ADC3: R32.1 ; port ADC3
ADC_ALERT_RDY: R28.2 U5.2(ALERT/RDY) ; port ADC_ALERT_RDY
GPS_INT: port GPS_INT, sheet SAM-M10Q/GPS_INT
GPS_NRST: port GPS_NRST, sheet SAM-M10Q/GPS_NRST
GPS_PPS: port GPS_PPS, sheet SAM-M10Q/GPS_PPS
GPS_PWR_EN: U4.7(ON2) ; port GPS_PWR_EN
GPS_RX: port GPS_RX, sheet SAM-M10Q/GPS_RX
GPS_TX: port GPS_TX, sheet SAM-M10Q/GPS_TX
IMU_PWR: R31.1 ; port ACC_PWR
INT1_IMU: port INT1_IMU, sheet BMA400/INT1_IMU
INT2_IMU: R47.1 ; port INT2_IMU, sheet BMA400/INT2_IMU
SCL: R40.1 U5.10(SCL) ; port I2C_SCL, sheet SAM-M10Q/GPS_SCL, sheet BMA400/IMU_SCL
SDA: R42.1 U5.9(SDA) ; port I2C_SDA, sheet SAM-M10Q/GPS_SDA, sheet BMA400/IMU_SDA
VADC_EN: U4.2(ON1) ; port VADC_EN
NetC15_1: C15.1 R27.2 U5.4(AIN0)
NetC16_1: C16.1 R30.2 U5.5(AIN1)
NetC17_1: C17.1 R32.2 U5.7(AIN3)
NetC18_1: C18.1 R33.2 U5.6(AIN2)
NetR26_2: R26.2 ; sheet SAM-M10Q/SAFE
NetR29_1: R29.1 R31.2 ; sheet BMA400/BMA_PWR

### Notes on the sheet
- Sensors load switch
- SR tie to GND = 75uS, tie to VCC = 660uS
- ADC 4 inputs
- Fc = 15.9kHz, adapt depending sampling rate
- 3-axis IMU
- (near R47) INT2 IMU not used
- Title
- Size:
- Date:
- A4
- Reference:
- Time:
- Revision:
- Sheet
- of
- File:

### Library data of the parts
C9 C11 C14 = GRM155R71C104KA88D: Multilayer Ceramic Capacitors MLCC - SMD/SMT 0.1 uF 16 VDC 10% 0402 X7R; Manufacturer_Part_Number: CC0402KRX7R7BB104; Manufacturer: YAGEO; Manufacturer 1: Murata; Description 1: 0402 0.1 uF 16V ±10 % Tolerance X7R SMT Multilayer Ceramic Capacitor; Voltage Rating: 16V; Package: C0402; Supplier 1: Mouser; Supplier Part Number 1: 81-GRM155R71C104KA88; Manufacturer Part Number 1: GRM155R71C104KA88D; RoHS 1: Yes; Category 1: Ceramic Capacitors; Stock 1: 7816691; Pricing 1: 1=0,1, 10=0,017, 50=0,017, 100=0,01, 1000=0,008, 10000=0,005 (USD); Mount: Surface Mount; Case/Package: 0402; Number of Pins: 2; Case Code (Metric): 1005; Case Code (Imperial): 0402; Material: Ceramic; Dielectric Material: Ceramic; Min Operating Temperature: -55°C; Max Operating Temperature: 125°C; Capacitance: 100nF; Tolerance: 10%; Packaging: Tape and Reel; Voltage Rating (DC): 16V; Package Quantity: 1; Dielectric: X7R; Termination: SMD/SMT; Voltage: 16V; Series: GRM; Length: 1mm; Width: 0.02inch; Height: 0.5mm; Thickness: 0.022inch; Depth: 0.5mm; Radiation Hardening: No; Lead Free: Lead Free; RoHS Compliant: Yes; Reach SVHC Compliant: Unknown; ComponentLink1URL: https://datasheet.ciiva.com/129/grm155r71c104ka88-01-129739.pdf?src-supplier=Digi-Key; ComponentLink1Description: https://datasheet.ciiva.com/129/grm155r71c104ka88-01-129739.pdf?src-supplier=Digi-Key; ComponentLink2URL: https://datasheet.ciiva.com/129/grm155r71c104ka88-01-129740.pdf?src-supplier=Digi-Key; ComponentLink2Description: https://datasheet.ciiva.com/129/grm155r71c104ka88-01-129740.pdf?src-supplier=Digi-Key; ComponentLink3URL: https://datasheet.ciiva.com/29199/454098-da-01-en-vs-kondensator-0402-29199799.pdf?src-supplier=Conrad; ComponentLink3Description: https://datasheet.ciiva.com/29199/454098-da-01-en-vs-kondensator-0402-29199799.pdf?src-supplier=Conrad; ComponentLink4URL: https://datasheet.ciiva.com/7937/4360-7937615.pdf?src-supplier=Element14; ComponentLink4Description: https://datasheet.ciiva.com/7937/4360-7937615.pdf?src-supplier=Element14; ComponentLink5URL: https://datasheet.ciiva.com/14116/grmseries-highdielectrictype-eng-14116878.pdf?src-supplier=Distrelec; ComponentLink5Description: https://datasheet.ciiva.com/14116/grmseries-highdielectrictype-eng-14116878.pdf?src-supplier=Distrelec; ComponentLink6URL: https://datasheet.ciiva.com/14103/grmseries-highdielectrictype-eng-14103750.pdf?src-supplier=Distrelec; ComponentLink6Description: https://datasheet.ciiva.com/14103/grmseries-highdielectrictype-eng-14103750.pdf?src-supplier=Distrelec; ComponentLink7URL: https://datasheet.ciiva.com/28534/4360-28534127.pdf?src-supplier=Element14; ComponentLink7Description: https://datasheet.ciiva.com/28534/4360-28534127.pdf?src-supplier=Element14; ComponentLink8URL: https://datasheet.ciiva.com/28534/4360-28534133.pdf?src-supplier=Element14; ComponentLink8Description: https://datasheet.ciiva.com/28534/4360-28534133.pdf?src-supplier=Element14
C10 C12 C13 = GRM155Z71A105KE01J: Multilayer Ceramic Capacitors MLCC - SMD/SMT 1.0UF 10V 10% 0402; Manufacturer_Name: Murata Electronics; Manufacturer 1: Murata; Description 1: Multi-Layer Ceramic Capacitor 1uF X7R 10% 0402 Paper T/R; Datasheet Link: http://www.murata.com/~/media/webrenewal/support/library/catalog/products/capacitor/mlcc/c02e.pdf; Height: 0.55mm; Manufacturer_Part_Number: GRM155Z71A105KE01J; Mouser Part Number: 81-GRM155Z71A105KE1J; Mouser Price/Stock: https://www.mouser.co.uk/ProductDetail/Murata-Electronics/GRM155Z71A105KE01J?qs=xZ%2FP%252Ba9zWqaF%2FmyRgV0iOA%3D%3D; Arrow Part Number: GRM155Z71A105KE01J; Arrow Price/Stock: https://www.arrow.com/en/products/grm155z71a105ke01j/murata-manufacturing?region=nac; Supplier 1: Mouser; Supplier Part Number 1: 81-GRM155Z71A105KE1J; Manufacturer Part Number 1: GRM155Z71A105KE01J; RoHS 1: Yes; Category 1: Ceramic Capacitors; Stock 1: 804340; Pricing 1: 1=0,1, 10=0,069, 50=0,069, 100=0,031, 1000=0,018, 10000=0,013 (USD); Supplier 2: Digi-Key; Supplier Part Number 2: 490-GRM155Z71A105KE01JCT-ND; Manufacturer 2: Murata; Manufacturer Part Number 2: GRM155Z71A105KE01J; RoHS 2: Yes; Description 2: Multi-Layer Ceramic Capacitor 1uF X7R 10% 0402 Paper T/R; Category 2: Ceramic Capacitors; Stock 2: 80025; Pricing 2: 1=0,1, 10=0,063, 50=0,0344, 100=0,0281, 500=0,02006, 1000=0,01577, 2500=0,01433, 5000=0,01319 (USD); Value: 1uF
C15-C18 = GRM1555CYA103GE01D: Multilayer Ceramic Capacitors MLCC - SMD/SMT 0.01 uF 35 VDC 2% 0402 C0G (NP0); Manufacturer_Name: Murata Electronics; Datasheet Link: https://search.murata.co.jp/Ceramy/image/img/A01X/G101/ENG/GRM1555CYA103GE01-01A.pdf; Height: 0.33mm; Manufacturer_Part_Number: GRM1555CYA103GE01D; Mouser Part Number: 81-GRM1555CYA103GE1D; Mouser Price/Stock: https://www.mouser.co.uk/ProductDetail/Murata-Electronics/GRM1555CYA103GE01D?qs=d0WKAl%252BL4Kaxz4NKPx2xBA%3D%3D
FB1 = BLM18HE601SN1D: Ferrite Beads 600 OHM 25%; Manufacturer_Name: Murata Electronics; Datasheet Link: http://www.murata.com/~/media/webrenewal/support/library/catalog/products/emc/emifil/c31e.ashx?la=en-gb; Height: 0.95mm; Manufacturer_Part_Number: BLM18HE601SN1D; Mouser Part Number: 81-BLM18HE601SN1D; Mouser Price/Stock: https://www.mouser.co.uk/ProductDetail/Murata-Electronics/BLM18HE601SN1D?qs=%2F%252BYoplLUB5hymM76VL7Sqw%3D%3D; Arrow Part Number: BLM18HE601SN1D; Arrow Price/Stock: https://www.arrow.com/en/products/blm18he601sn1d/murata-manufacturing?utm_currency=USD&region=nac
R26 = RES-NC-0402: Generic Resistor, Not Fitted; Internal_Part_Number: MCD-00052; Manufacturer_Part_Number: RC0402JR-070RL; Manufacturer: YAGEO; Provided_By: SUBCO; Initial_Board_Reference: MB1274; Status: Released; Part_Type: Resistor; Package: R0402; ComponentLink1Description: Datasheet; ComponentLink1URL: http://tunmcdsvn.tun.st.com/Component_Datasheet_Library/Trunk/Resistors/Yageo_Resistor_RC0402-series
R27 R30 R32 R33 = CRCW02011K00FNED: as R3 on sheet linkit-v4; Datasheet Link: http://www.vishay.com/docs/20035/dcrcwe3.pdf; Height: 0.28mm; Manufacturer_Part_Number: CRCW02011K00FNED; Mouser Part Number: 71-CRCW02011K00FNED; Mouser Price/Stock: https://www.mouser.co.uk/ProductDetail/Vishay-Dale/CRCW02011K00FNED?qs=IQLUlsvFoXtTp7ngtIXo7A%3D%3D; Arrow Part Number: CRCW02011K00FNED; Arrow Price/Stock: https://www.arrow.com/en/products/crcw02011k00fned/vishay?region=nac; Value: 1KR
R28 = RC0201FR-7D1ML: as R18 on sheet mcu; Datasheet Link: http://www.yageo.com/documents/recent/PYu-RC0201_51_RoHS_L_8.pdf; Height: 0.26mm; Manufacturer_Part_Number: RC0201FR-7D1ML; Mouser Part Number: 603-RC0201FR-7D1ML; Mouser Price/Stock: https://www.mouser.co.uk/ProductDetail/YAGEO/RC0201FR-7D1ML?qs=NgbZBzc1CyEo5FlGf5N0Ug%3D%3D; Arrow Part Number: RC0201FR-7D1ML; Arrow Price/Stock: https://www.arrow.com/en/products/rc0201fr-7d1ml/yageo
R29 = RES NF 0402: Manufacturer: NOT FITTED PART; Manufacturers Part Number: NOT FITTED PART; Size: 0402; Supplier 1: Mouser; Supplier 2: Digi-Key
R31 = RES 0R 0402: Manufacturer: *; Manufacturers Part Number: *; Size: 0402; Supplier 1: Mouser; Supplier 2: Digi-Key; Supplier Part Number 1: 603-RC0402JR-070RL; Supplier Part Number 2: 311-0.0JRCT-ND
R40 R42 = RES 4.7K 0201 1% 100PPM: PPM: 100; Manufacturer: *; Manufacturers Part Number: *; Tolerance: 1%; Size: 0201; Supplier 1: Mouser; Supplier 2: Digi-Key; Supplier Part Number 1: 71-CRCW02014K70FKED; Supplier Part Number 2: 541-4.70KAABCT-ND
R47 = CRCW0201100KJNED: Thick Film Resistors - SMD 1/20watt 100Kohms 5% 200ppm; Manufacturer_Name: Vishay; Datasheet Link: http://www.vishay.com/docs/20035/dcrcwe3.pdf; Height: 0.28mm; Manufacturer_Part_Number: CRCW0201100KJNED; Mouser Part Number: 71-CRCW0201100KJNED; Mouser Price/Stock: https://www.mouser.co.uk/ProductDetail/Vishay-Dale/CRCW0201100KJNED?qs=IQLUlsvFoXu8A8gHIw6owA%3D%3D; Arrow Part Number: CRCW0201100KJNED; Arrow Price/Stock: https://www.arrow.com/en/products/crcw0201100kjned/vishay
U4 = TPS22960RSER: Power Switch ICs - Power Distribution Low Input VTG Dual L oad Switch; Manufacturer_Name: Texas Instruments; Datasheet Link: https://www.ti.com/lit/ds/symlink/tps22960.pdf?ts=1638681846865&ref_url=https%253A%252F%252Fwww.google.com%252F; Height: 0.6mm; Manufacturer_Part_Number: TPS22960RSER; Mouser Part Number: 595-TPS22960RSER; Mouser Price/Stock: https://www.mouser.co.uk/ProductDetail/Texas-Instruments/TPS22960RSER?qs=EQxOuqCyzqQpKHLEcq5RSg%3D%3D; Arrow Part Number: TPS22960RSER; Arrow Price/Stock: https://www.arrow.com/en/products/tps22960rser/texas-instruments?region=nac
U5 = ADS1115IRUGR: Analog to Digital Converters - ADC 16B ADC w/ Int MUX P GA Comp Osc & Ref A; Manufacturer_Name: Texas Instruments; Datasheet Link: https://www.ti.com/lit/ds/symlink/ads1115.pdf?ts=1601235703022&ref_url=https%253A%252F%252Fwww.ti.com%252Fproduct%252FADS1115%253FkeyMatch%253DADS1115IRUGR%2526tisearch%253DSearch-EN-everything%2526usecase%253DOPN; Height: 0.4mm; Manufacturer_Part_Number: ADS1115IRUGR; Mouser Part Number: 595-ADS1115IRUGR; Mouser Price/Stock: https://www.mouser.co.uk/ProductDetail/Texas-Instruments/ADS1115IRUGR?qs=IK5e5L0zOXhqw%2F8AHSSbuA%3D%3D; Arrow Part Number: ADS1115IRUGR; Arrow Price/Stock: https://www.arrow.com/en/products/ads1115irugr/texas-instruments?utm_currency=USD&region=nac